# Altium schematic sheet 康芯开发板.SchDoc
size A4; PageSetup: Record=PageOptions|CenterHorizontal=True|CenterVertical=True|PrintScale=0.97|XCorrection=1.00|YCorrection=1.00|PrintKind=2|BorderSize=5000000|LeftOffset=0|BottomOffset=0|Orientation=2|PaperLength=1000|PaperWidth=1000|Scale=100|PaperSource=7|PrintQuality=-4|MediaType=1|DitherType=10|PaperKind=A4|PrintScaleMode=1
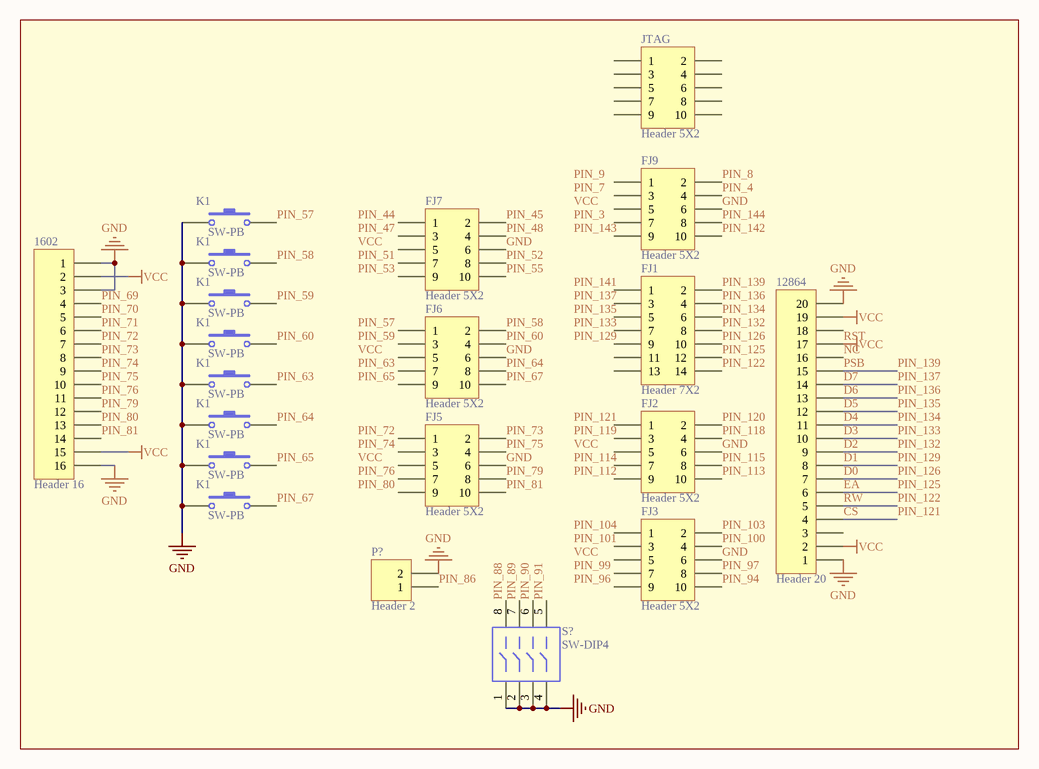
[diagram p0: 康芯开发板.SchDoc]

## Parts
(Parts that share a designator on the sheet are numbered #1, #2 ... from top to bottom, then left to right.)
1602  Header 16  [HDR1X16]
12864  Header 20  [HDR1X20]
FJ1  Header 7X2  [HDR2X7]
FJ2  Header 5X2  [HDR2X5]
FJ3  Header 5X2  [HDR2X5]
FJ5  Header 5X2  [HDR2X5]
FJ6  Header 5X2  [HDR2X5]
FJ7  Header 5X2  [HDR2X5]
FJ9  Header 5X2  [HDR2X5]
JTAG  Header 5X2  [HDR2X5]
K1#1  SW-PB  [SPST-2]
K1#2  SW-PB  [SPST-2]
K1#3  SW-PB  [SPST-2]
K1#4  SW-PB  [SPST-2]
K1#5  SW-PB  [SPST-2]
K1#6  SW-PB  [SPST-2]
K1#7  SW-PB  [SPST-2]
K1#8  SW-PB  [SPST-2]
P?  Header 2  [HDR1X2]
S?  SW-DIP4  [DIP-8]

## Nets
GND: 1602.1 1602.3 1602.16 12864.1 12864.20 FJ2.6 FJ3.6 FJ5.6 FJ6.6 FJ7.6 FJ9.6 K1#1.1 K1#2.1 K1#3.1 K1#4.1 K1#5.1 K1#6.1 K1#7.1 K1#8.1 P?.2 S?.1 S?.2 S?.3 S?.4
RST: 1602.2 1602.15 12864.2 12864.17 12864.19  [also labelled VCC]
CS: 12864.4  [also labelled PIN_121]
D0: 12864.7 FJ1.10  [also labelled PIN_126]
D1: 12864.8  [also labelled PIN_129]
D2: 12864.9 FJ1.8  [also labelled PIN_132]
D3: 12864.10  [also labelled PIN_133]
D4: 12864.11 FJ1.6  [also labelled PIN_134]
D5: 12864.12  [also labelled PIN_135]
D6: 12864.13 FJ1.4  [also labelled PIN_136]
D7: 12864.14  [also labelled PIN_137]
EA: 12864.6 FJ1.12  [also labelled PIN_125]
NC: 12864.16
PIN_4: FJ9.4
PIN_8: FJ9.2
PIN_45: FJ7.2
PIN_48: FJ7.4
PIN_52: FJ7.8
PIN_55: FJ7.10
PIN_57: K1#1.2
PIN_58: FJ6.2 K1#2.2
PIN_59: K1#3.2
PIN_60: FJ6.4 K1#4.2
PIN_63: K1#5.2
PIN_64: FJ6.8 K1#6.2
PIN_65: K1#7.2
PIN_67: FJ6.10 K1#8.2
PIN_69: 1602.4
PIN_70: 1602.5
PIN_71: 1602.6
PIN_72: 1602.7
PIN_73: 1602.8 FJ5.2
PIN_74: 1602.9
PIN_75: 1602.10 FJ5.4
PIN_76: 1602.11
PIN_79: 1602.12 FJ5.8
PIN_80: 1602.13
PIN_81: 1602.14 FJ5.10
PIN_86: P?.1
PIN_88: S?.8
PIN_89: S?.7
PIN_90: S?.6
PIN_91: S?.5
PIN_94: FJ3.10
PIN_97: FJ3.8
PIN_100: FJ3.4
PIN_103: FJ3.2
PIN_113: FJ2.10
PIN_115: FJ2.8
PIN_118: FJ2.4
PIN_120: FJ2.2
PIN_122: 12864.5 FJ1.14  [also labelled RW]
PIN_139: 12864.15 FJ1.2  [also labelled PSB]
PIN_142: FJ9.10
PIN_144: FJ9.8

Not connected (* = marked no-connect by the designer): 12864 3 18; FJ1 1 3 5 7 9 11 13; FJ2 1 3 5 7 9; FJ3 1 3 5 7 9; FJ5 1 3 5 7 9; FJ6 1 3 5 7 9; FJ7 1 3 5 7 9; FJ9 1 3 5 7 9; JTAG 1 2 3 4 5 6 7 8 9 10

## Notes on the sheet
- Labels drawn without touching a wire or pin: PIN_3, PIN_7, PIN_9, PIN_44, PIN_47, PIN_51, PIN_53, PIN_57, PIN_59, PIN_63, PIN_65, PIN_72, PIN_74, PIN_76, PIN_80, PIN_96, PIN_99, PIN_101, PIN_104, PIN_112, PIN_114, PIN_119, PIN_121, PIN_129, PIN_133, PIN_135, PIN_137, PIN_141, PIN_143, VCC

## Library data of the parts
1602 = Header 16: Header, 16-Pin; LatestRevisionDate: 17-Jul-2002; LatestRevisionNote: Re-released for DXP Platform.; Publisher: Altium Limited
12864 = Header 20: Header, 20-Pin; LatestRevisionDate: 17-Jul-2002; LatestRevisionNote: Re-released for DXP Platform.; Publisher: Altium Limited
FJ1 = Header 7X2: Header, 7-Pin, Dual row; LatestRevisionDate: 17-Jul-2002; LatestRevisionNote: Re-released for DXP Platform.; Publisher: Altium Limited
FJ2 FJ3 FJ5-FJ7 FJ9 JTAG = Header 5X2: Header, 5-Pin, Dual row; LatestRevisionDate: 17-Jul-2002; LatestRevisionNote: Re-released for DXP Platform.; Publisher: Altium Limited
K1#1-K1#8 = SW-PB: Switch; Published: 24-Mar-1999; LatestRevisionDate: 17-Jul-2002; LatestRevisionNote: Re-released for DXP Platform.; PackageReference: SPST-2; Publisher: Altium Limited
P? = Header 2: Header, 2-Pin; LatestRevisionDate: 17-Jul-2002; LatestRevisionNote: Re-released for DXP Platform.; Publisher: Altium Limited
S? = SW-DIP4: DIP Switch; Published: 24-Mar-1999; LatestRevisionDate: 17-Jul-2002; LatestRevisionNote: Re-released for DXP Platform.; PackageReference: DIP-8; Publisher: Altium Limited